# Altium schematic sheet 31.SchDoc
size A2
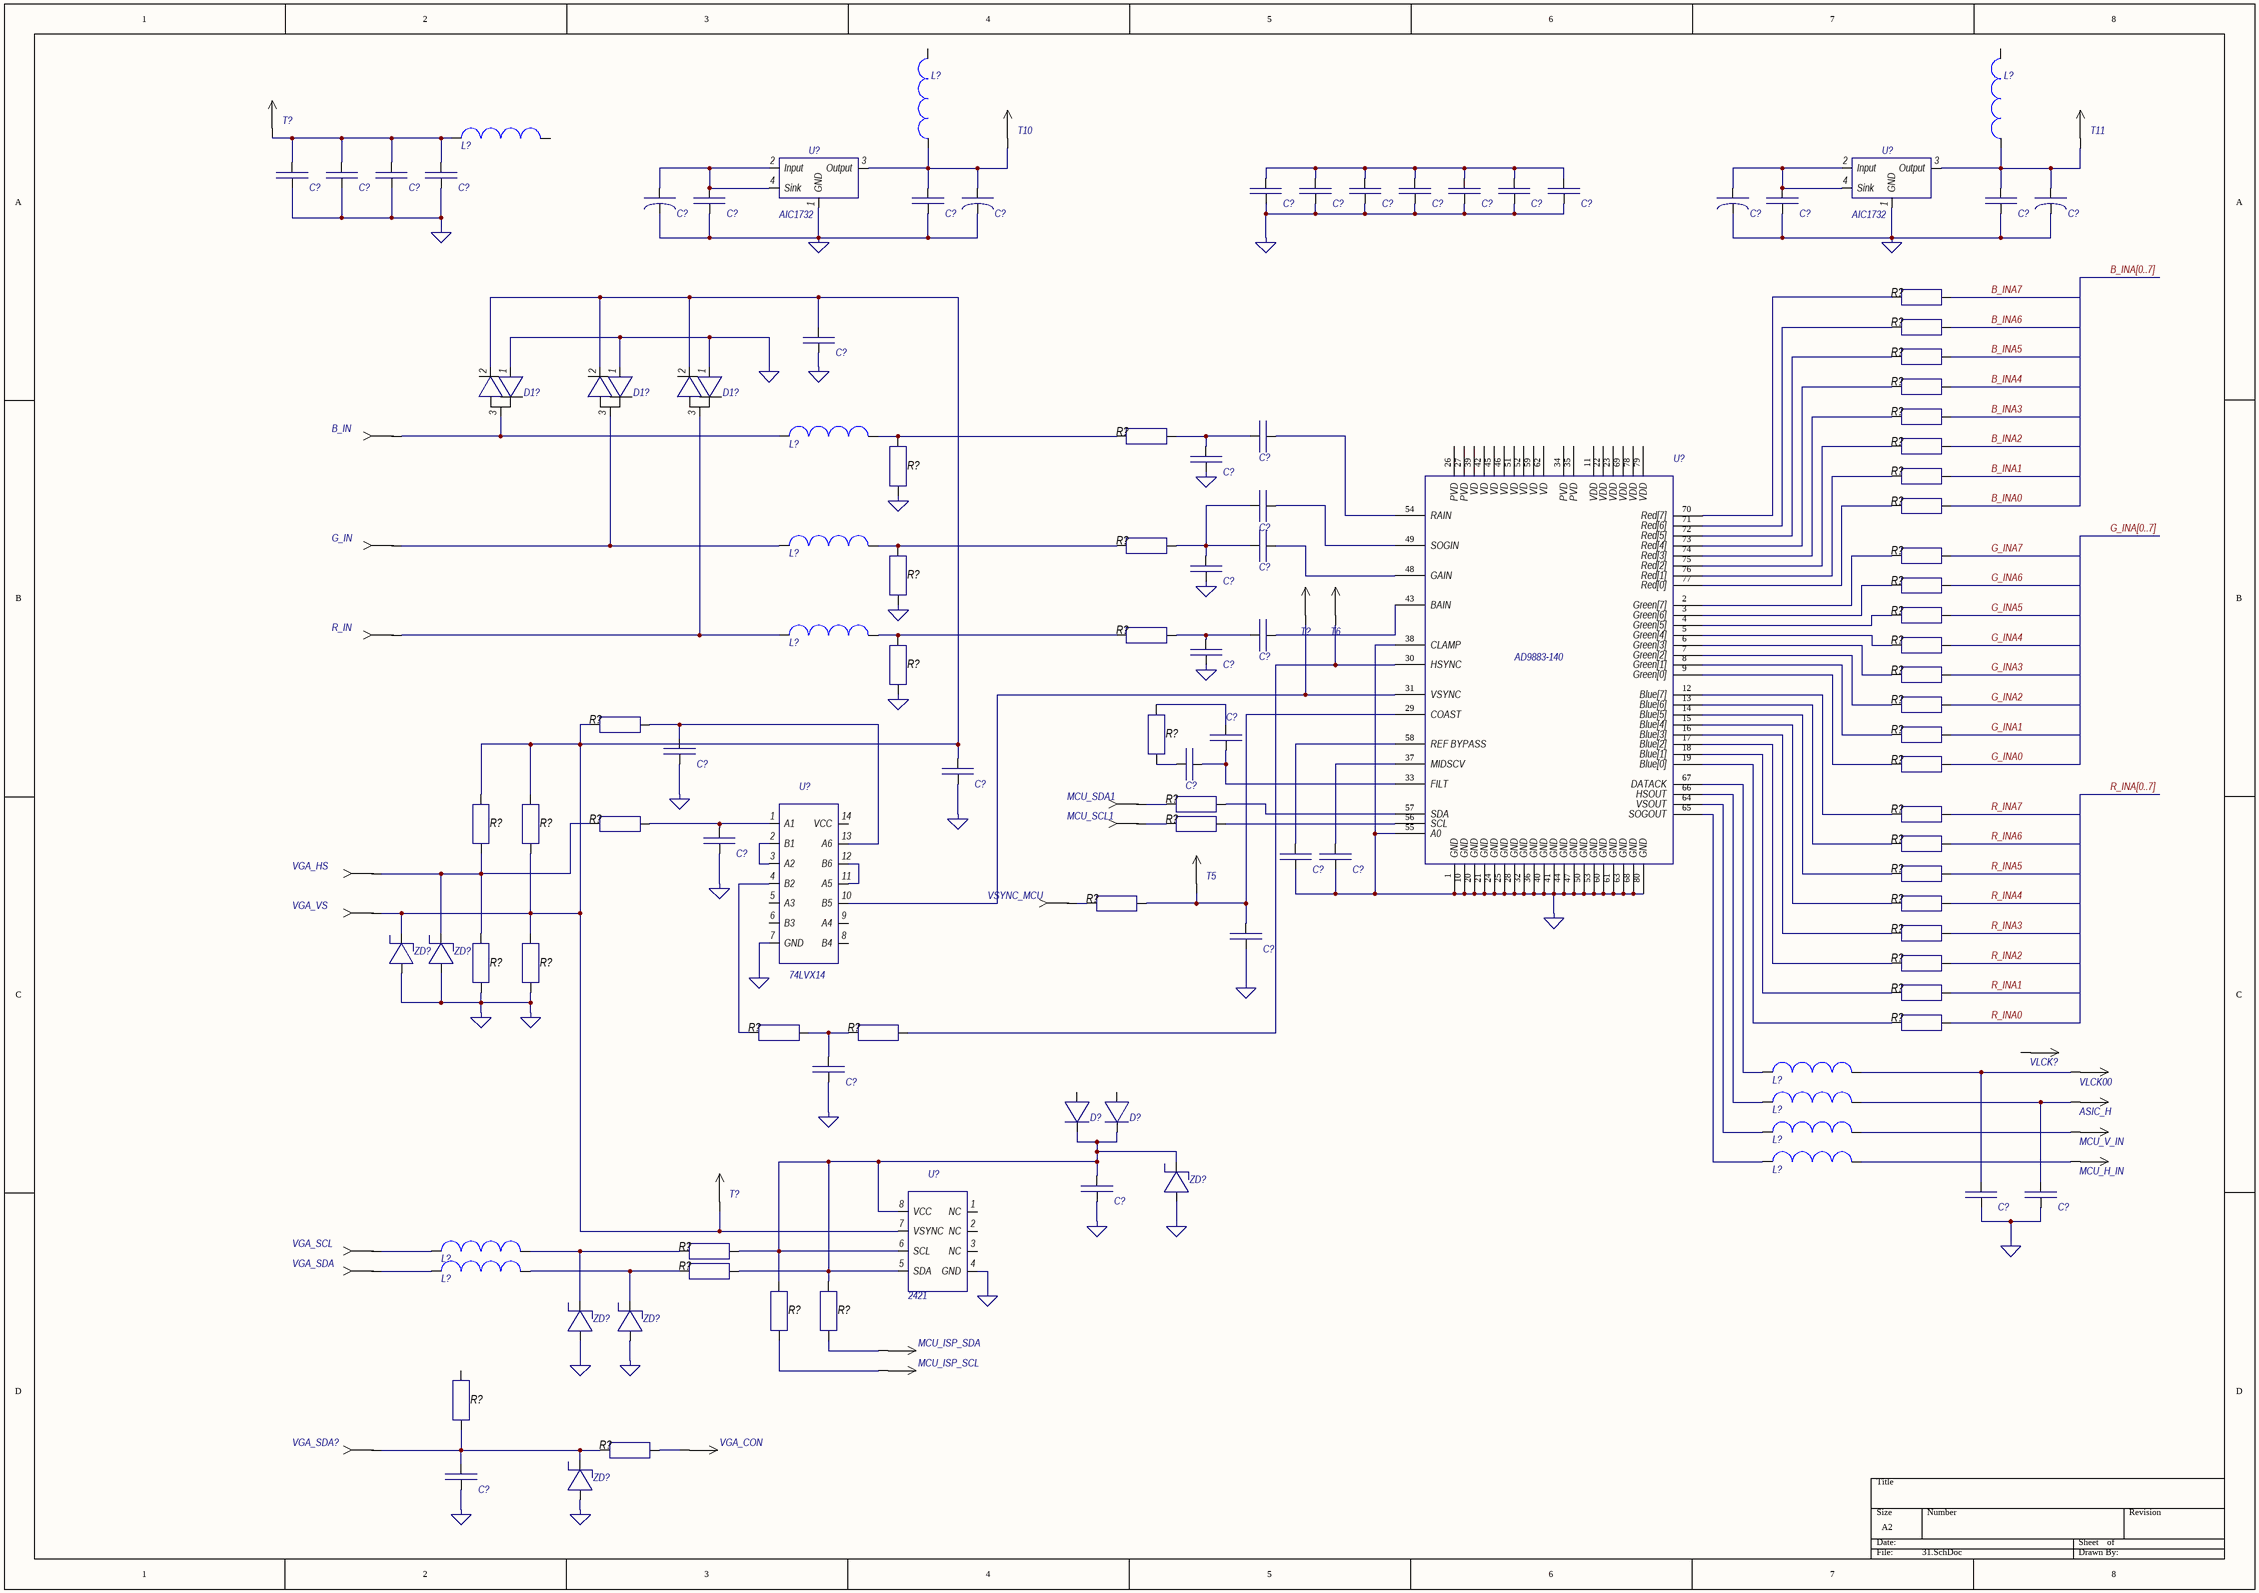
[diagram p0: 31.SchDoc]

## Parts
(Parts that share a designator on the sheet are numbered #1, #2 ... from top to bottom, then left to right.)
ASIC_H  OutputArrow  (value not drawn)
B_IN  InputArrow  (value not drawn)
C?#1  Capacitor  [Cap_tantal_D]  (value not drawn)
C?#2  Capacitor  [Cap_tantal_D]  (value not drawn)
C?#3  Capacitor  [Cap_tantal_D]  (value not drawn)
C?#4  Capacitor  [Cap_tantal_D]  (value not drawn)
C?#5  Capacitor  [Cap_tantal_D]  (value not drawn)
C?#6  Capacitor  [Cap_tantal_D]  (value not drawn)
C?#7  Capacitor  [Cap_tantal_D]  (value not drawn)
C?#8  Capacitor  [Cap_tantal_D]  (value not drawn)
C?#9  Capacitor  [Cap_tantal_D]  (value not drawn)
C?#10  Capacitor  [Cap_tantal_D]  (value not drawn)
C?#11  Capacitor  [Cap_tantal_D]  (value not drawn)
C?#12  TuningCapacitor  (value not drawn)
C?#13  Capacitor  [Cap_tantal_D]  (value not drawn)
C?#14  Capacitor  [Cap_tantal_D]  (value not drawn)
C?#15  TuningCapacitor  (value not drawn)
C?#16  TuningCapacitor  (value not drawn)
C?#17  Capacitor  [Cap_tantal_D]  (value not drawn)
C?#18  Capacitor  [Cap_tantal_D]  (value not drawn)
C?#19  TuningCapacitor  (value not drawn)
C?#20  Capacitor  [Cap_tantal_D]  (value not drawn)
C?#21  Capacitor  [Cap_tantal_D]  (value not drawn)
C?#22  Capacitor  [Cap_tantal_D]  (value not drawn)
C?#23  Capacitor  [Cap_tantal_D]  (value not drawn)
C?#24  Capacitor  [Cap_tantal_D]  (value not drawn)
C?#25  Capacitor  [Cap_tantal_D]  (value not drawn)
C?#26  Capacitor  [Cap_tantal_D]  (value not drawn)
C?#27  Capacitor  [Cap_tantal_D]  (value not drawn)
C?#28  Capacitor  [Cap_tantal_D]  (value not drawn)
C?#29  Capacitor  [Cap_tantal_D]  (value not drawn)
C?#30  Capacitor  [Cap_tantal_D]  (value not drawn)
C?#31  Capacitor  [Cap_tantal_D]  (value not drawn)
C?#32  Capacitor  [Cap_tantal_D]  (value not drawn)
C?#33  Capacitor  [Cap_tantal_D]  (value not drawn)
C?#34  Capacitor  [Cap_tantal_D]  (value not drawn)
C?#35  Capacitor  [Cap_tantal_D]  (value not drawn)
C?#36  Capacitor  [Cap_tantal_D]  (value not drawn)
C?#37  Capacitor  [Cap_tantal_D]  (value not drawn)
C?#38  Capacitor  [Cap_tantal_D]  (value not drawn)
C?#39  Capacitor  [Cap_tantal_D]  (value not drawn)
C?#40  Capacitor  [Cap_tantal_D]  (value not drawn)
D1?#1  TripleDiode  (value not drawn)
D1?#2  TripleDiode  (value not drawn)
D1?#3  TripleDiode  (value not drawn)
D?#1  Diode  [zener_diode]  (value not drawn)
D?#2  Diode  [zener_diode]  (value not drawn)
G_IN  InputArrow  (value not drawn)
L?#1  *  (value not drawn)
L?#2  *  (value not drawn)
L?#3  *  (value not drawn)
L?#4  *  (value not drawn)
L?#5  *  (value not drawn)
L?#6  *  (value not drawn)
L?#7  *  (value not drawn)
L?#8  *  (value not drawn)
L?#9  *  (value not drawn)
L?#10  *  (value not drawn)
L?#11  *  (value not drawn)
L?#12  *  (value not drawn)
MCU_H_IN  OutputArrow  (value not drawn)
MCU_ISP_SCL  OutputArrow  (value not drawn)
MCU_ISP_SDA  OutputArrow  (value not drawn)
MCU_SCL1  InputArrow  (value not drawn)
MCU_SDA1  InputArrow  (value not drawn)
MCU_V_IN  OutputArrow  (value not drawn)
R?#1  *  [R_1206]  (value not drawn)
R?#2  *  [R_1206]  (value not drawn)
R?#3  *  [R_1206]  (value not drawn)
R?#4  *  [R_1206]  (value not drawn)
R?#5  *  [R_1206]  (value not drawn)
R?#6  *  [R_1206]  (value not drawn)
R?#7  *  [R_1206]  (value not drawn)
R?#8  *  [R_1206]  (value not drawn)
R?#9  *  [R_1206]  (value not drawn)
R?#10  *  [R_1206]  (value not drawn)
R?#11  *  [R_1206]  (value not drawn)
R?#12  *  [R_1206]  (value not drawn)
R?#13  *  [R_1206]  (value not drawn)
R?#14  *  [R_1206]  (value not drawn)
R?#15  *  [R_1206]  (value not drawn)
R?#16  *  [R_1206]  (value not drawn)
R?#17  *  [R_1206]  (value not drawn)
R?#18  *  [R_1206]  (value not drawn)
R?#19  *  [R_1206]  (value not drawn)
R?#20  *  [R_1206]  (value not drawn)
R?#21  *  [R_1206]  (value not drawn)
R?#22  *  [R_1206]  (value not drawn)
R?#23  *  [R_1206]  (value not drawn)
R?#24  *  [R_1206]  (value not drawn)
R?#25  *  [R_1206]  (value not drawn)
R?#26  *  [R_1206]  (value not drawn)
R?#27  *  [R_1206]  (value not drawn)
R?#28  *  [R_1206]  (value not drawn)
R?#29  *  [R_1206]  (value not drawn)
R?#30  *  [R_1206]  (value not drawn)
R?#31  *  [R_1206]  (value not drawn)
R?#32  *  [R_1206]  (value not drawn)
R?#33  *  [R_1206]  (value not drawn)
R?#34  *  [R_1206]  (value not drawn)
R?#35  *  [R_1206]  (value not drawn)
R?#36  *  [R_1206]  (value not drawn)
R?#37  *  [R_1206]  (value not drawn)
R?#38  *  [R_1206]  (value not drawn)
R?#39  *  [R_1206]  (value not drawn)
R?#40  *  [R_1206]  (value not drawn)
R?#41  *  [R_1206]  (value not drawn)
R?#42  *  [R_1206]  (value not drawn)
R?#43  *  [R_1206]  (value not drawn)
R?#44  *  [R_1206]  (value not drawn)
R?#45  *  [R_1206]  (value not drawn)
R?#46  *  [R_1206]  (value not drawn)
R?#47  *  [R_1206]  (value not drawn)
R?#48  *  [R_1206]  (value not drawn)
R_IN  InputArrow  (value not drawn)
T5  OutputArrow  (value not drawn)
T6  OutputArrow  (value not drawn)
T10  OutputArrow  (value not drawn)
T11  OutputArrow  (value not drawn)
T?#1  OutputArrow  (value not drawn)
T?#2  OutputArrow  (value not drawn)
T?#3  OutputArrow  (value not drawn)
U?#1  AIC1732
U?#2  AIC1732
U?#3  AD9883-140  [ST_80_2_ADI]
U?#4  74LVX14
U?#5  2421
VGA_CON  OutputArrow  (value not drawn)
VGA_HS  InputArrow  (value not drawn)
VGA_SCL  InputArrow  (value not drawn)
VGA_SDA  InputArrow  (value not drawn)
VGA_SDA?  InputArrow  (value not drawn)
VGA_VS  InputArrow  (value not drawn)
VLCK00  OutputArrow  (value not drawn)
VLCK?  OutputArrow  (value not drawn)
VSYNC_MCU  InputArrow  (value not drawn)
ZD?#1  DiodeSchottky  [zener_diode]  (value not drawn)
ZD?#2  DiodeSchottky  [zener_diode]  (value not drawn)
ZD?#3  DiodeSchottky  [zener_diode]  (value not drawn)
ZD?#4  DiodeSchottky  [zener_diode]  (value not drawn)
ZD?#5  DiodeSchottky  [zener_diode]  (value not drawn)
ZD?#6  DiodeSchottky  [zener_diode]  (value not drawn)

## Nets
GND: C?#1.2 C?#2.2 C?#3.2 C?#4.2 C?#5.2 C?#6.2 C?#7.2 C?#8.2 C?#9.2 C?#10.2 C?#11.2 C?#12.2 C?#13.2 C?#14.2 C?#15.2 C?#16.2 C?#17.2 C?#18.2 C?#19.2 C?#20.2 C?#22.2 C?#25.2 C?#27.2 C?#28.2 C?#30.2 C?#32.2 C?#33.1 C?#34.1 C?#35.1 C?#36.2 C?#37.2 C?#38.2 C?#39.2 C?#40.2 D1?#1.1 D1?#2.1 D1?#3.1 R?#10.1 R?#15.1 R?#21.1 R?#38.1 R?#39.1 U?#1.1(GND) U?#2.1(GND) U?#3.1(GND) U?#3.10(GND) U?#3.20(GND) U?#3.21(GND) U?#3.24(GND) U?#3.25(GND) U?#3.28(GND) U?#3.32(GND) U?#3.36(GND) U?#3.38(CLAMP) U?#3.40(GND) U?#3.41(GND) U?#3.44(GND) U?#3.47(GND) U?#3.50(GND) U?#3.53(GND) U?#3.55(A0) U?#3.60(GND) U?#3.61(GND) U?#3.63(GND) U?#3.68(GND) U?#3.80(GND) U?#4.7(GND) U?#5.4(GND) ZD?#1.1 ZD?#2.1 ZD?#3.1 ZD?#4.1 ZD?#5.1 ZD?#6.1
B_INA0: R?#9.2
B_INA1: R?#8.2
B_INA2: R?#7.2
B_INA3: R?#5.2
B_INA4: R?#4.2
B_INA5: R?#3.2
B_INA6: R?#2.2
B_INA7: R?#1.2
G_INA0: R?#23.2
G_INA1: R?#22.2
G_INA2: R?#19.2
G_INA3: R?#18.2
G_INA4: R?#17.2
G_INA5: R?#14.2
G_INA6: R?#13.2
G_INA7: R?#12.2
R_INA0: R?#40.2
R_INA1: R?#37.2
R_INA2: R?#36.2
R_INA3: R?#35.2
R_INA4: R?#34.2
R_INA5: R?#30.2
R_INA6: R?#29.2
R_INA7: R?#26.2
NetASIC_H_3: ASIC_H.3 C?#39.1 L?#8.2
NetB_IN_4: B_IN.4 D1?#1.3 L?#4.1
NetC?#1_1: C?#1.1 C?#2.1 C?#3.1 C?#4.1 L?#1.1 T?#1.3
NetC?#5_1: C?#5.1 C?#6.1 C?#7.1 C?#8.1 C?#9.1 C?#10.1 C?#11.1
NetC?#12_1: C?#12.1 C?#13.1 U?#1.2(Input) U?#1.4(Sink)
NetC?#14_1: C?#14.1 C?#15.1 L?#2.1 T10.3 U?#1.3(Output)
NetC?#16_1: C?#16.1 C?#17.1 U?#2.2(Input) U?#2.4(Sink)
NetC?#18_1: C?#18.1 C?#19.1 L?#3.1 T11.3 U?#2.3(Output)
NetC?#20_1: C?#20.1 C?#30.1 D1?#1.2 D1?#2.2 D1?#3.2 R?#20.1 R?#31.2 R?#32.1 R?#32.2 R?#39.2 T?#3.3 U?#5.7(VSYNC) VGA_VS.4 ZD?#1.2
NetC?#21_1: C?#21.1 U?#3.54(RAIN)
NetC?#21_2: C?#21.2 C?#22.1 R?#6.2
NetC?#23_1: C?#23.1 U?#3.49(SOGIN)
NetC?#23_2: C?#23.2 C?#24.2 C?#25.1 R?#11.2
NetC?#24_1: C?#24.1 U?#3.48(GAIN)
NetC?#26_1: C?#26.1 U?#3.43(BAIN)
NetC?#26_2: C?#26.2 C?#27.1 R?#16.2
NetC?#28_1: C?#28.1 R?#20.2 U?#4.13(A6)
NetC?#29_1: C?#29.1 C?#31.1 U?#3.33(FILT)
NetC?#29_2: C?#29.2 R?#24.2
NetC?#31_2: C?#31.2 R?#24.1
NetC?#32_1: C?#32.1 R?#27.2 U?#4.1(A1)
NetC?#33_2: C?#33.2 U?#3.58(REF_BYPASS)
NetC?#34_2: C?#34.2 U?#3.37(MIDSCV)
NetC?#35_2: C?#35.2 R?#33.2 T5.3 U?#3.29(COAST)
NetC?#36_1: C?#36.1 R?#41.2 R?#42.1
NetC?#37_1: C?#37.1 D?#1.2 D?#2.2 R?#43.2 R?#44.2 R?#45.2 R?#46.2 U?#5.5(SDA) U?#5.6(SCL) U?#5.8(VCC) ZD?#3.2
NetC?#38_1: C?#38.1 L?#7.2 VLCK00.3
NetC?#40_1: C?#40.1 R?#47.1 R?#48.1 VGA_SDA?.4 ZD?#6.2
NetD1?#2_3: D1?#2.3 G_IN.4 L?#5.1
NetD1?#3_3: D1?#3.3 L?#6.1 R_IN.4
NetL?#4_2: L?#4.2 R?#6.1 R?#10.2
NetL?#5_2: L?#5.2 R?#11.1 R?#15.2
NetL?#6_2: L?#6.2 R?#16.1 R?#21.2
NetL?#7_1: L?#7.1 U?#3.67(DATACK)
NetL?#8_1: L?#8.1 U?#3.66(HSOUT)
NetL?#9_1: L?#9.1 U?#3.64(VSOUT)
NetL?#9_2: L?#9.2 MCU_V_IN.3
NetL?#10_1: L?#10.1 U?#3.65(SOGOUT)
NetL?#10_2: L?#10.2 MCU_H_IN.3
NetL?#11_1: L?#11.1 VGA_SCL.4
NetL?#11_2: L?#11.2 R?#43.1 ZD?#4.2
NetL?#12_1: L?#12.1 VGA_SDA.4
NetL?#12_2: L?#12.2 R?#44.1 ZD?#5.2
NetMCU_ISP_SCL_3: MCU_ISP_SCL.3 R?#45.1
NetMCU_ISP_SDA_3: MCU_ISP_SDA.3 R?#46.1
NetMCU_SCL1_4: MCU_SCL1.4 R?#28.1
NetMCU_SDA1_4: MCU_SDA1.4 R?#25.1
NetR?#1_1: R?#1.1 U?#3.70(Red[7])
NetR?#2_1: R?#2.1 U?#3.71(Red[6])
NetR?#3_1: R?#3.1 U?#3.72(Red[5])
NetR?#4_1: R?#4.1 U?#3.73(Red[4])
NetR?#5_1: R?#5.1 U?#3.74(Red[3])
NetR?#7_1: R?#7.1 U?#3.75(Red[2])
NetR?#8_1: R?#8.1 U?#3.76(Red[1])
NetR?#9_1: R?#9.1 U?#3.77(Red[0])
NetR?#12_1: R?#12.1 U?#3.2(Green[7])
NetR?#13_1: R?#13.1 U?#3.3(Green[6])
NetR?#14_1: R?#14.1 U?#3.4(Green[5])
NetR?#17_1: R?#17.1 U?#3.5(Green[4])
NetR?#18_1: R?#18.1 U?#3.6(Green[3])
NetR?#19_1: R?#19.1 U?#3.7(Green[2])
NetR?#22_1: R?#22.1 U?#3.8(Green[1])
NetR?#23_1: R?#23.1 U?#3.9(Green[0])
NetR?#25_2: R?#25.2 U?#3.57(SDA)
NetR?#26_1: R?#26.1 U?#3.12(Blue[7])
NetR?#27_1: R?#27.1 R?#31.1 R?#38.2 VGA_HS.4 ZD?#2.2
NetR?#28_2: R?#28.2 U?#3.56(SCL)
NetR?#29_1: R?#29.1 U?#3.13(Blue[6])
NetR?#30_1: R?#30.1 U?#3.14(Blue[5])
NetR?#33_1: R?#33.1 VSYNC_MCU.4
NetR?#34_1: R?#34.1 U?#3.15(Blue[4])
NetR?#35_1: R?#35.1 U?#3.16(Blue[3])
NetR?#36_1: R?#36.1 U?#3.17(Blue[2])
NetR?#37_1: R?#37.1 U?#3.18(Blue[1])
NetR?#40_1: R?#40.1 U?#3.19(Blue[0])
NetR?#41_1: R?#41.1 U?#4.4(B2)
NetR?#42_2: R?#42.2 T6.3 U?#3.30(HSYNC)
NetR?#47_2: R?#47.2 VGA_CON.3
NetT?#2_3: T?#2.3 U?#3.31(VSYNC) U?#4.10(B5)
NetU?#4_2: U?#4.2(B1) U?#4.3(A2)
NetU?#4_11: U?#4.11(A5) U?#4.12(B6)

Not connected (* = marked no-connect by the designer): D?#1 1; D?#2 1; L?#1 2; L?#2 2; L?#3 2; R?#48 2; U?#3 11(VDD) 22(VDD) 23(VDD) 26(PVD) 27(PVD) 34(PVD) 35(PVD) 39(VD) 42(VD) 45(VD) 46(VD) 51(VD) 52(VD) 59(VD) 62(VD) 69(VDD) 78(VDD) 79(VDD); U?#4 5(A3) 6(B3) 8(B4) 9(A4) 14(VCC); U?#5 1(NC) 2(NC) 3(NC); VLCK? 3

## Buses and harness runs
bus B_INA[0..7]
bus G_INA[0..7]
bus R_INA[0..7]

## Library data of the parts
L?#1-L?#12 = Inductor
R?#1-R?#48 = Resistor
U?#3 = AD9883ABSTZ-140: No Description Available; Built_By: EMA_UL_Team; Vendor: Analog Devices Inc; SourceLibrary: Analog_2012-01-01_6; Manufacturer_Part_Number: AD9883ABSTZ-140; Copyright: Copyright (C) 2018 Accelerated Designs. All rights reserved; RefDes: RefDes; Type: DEV